# Altium schematic sheet 3.3v REG.SchDoc
size A; SheetNumber: 10; SheetTotal: 12
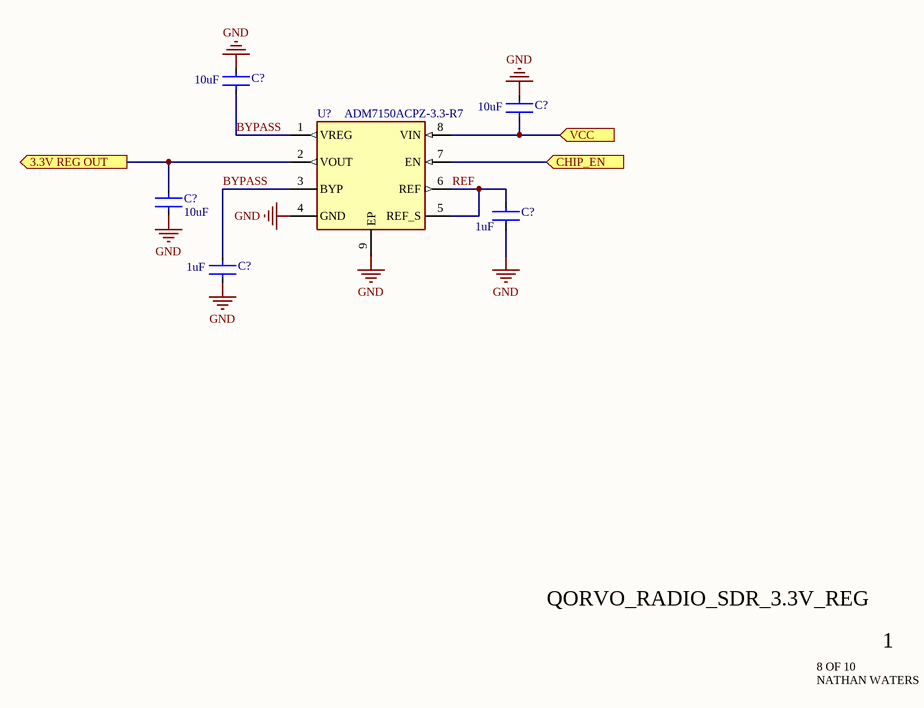
[diagram p0: 3.3v REG.SchDoc]

## Parts
(Parts that share a designator on the sheet are numbered #1, #2 ... from top to bottom, then left to right.)
C?#1  Capacitance: 10uF  [FP-GRM188-0_2-IPC_A]  (hidden comment: GRM188C81C106MA73D)
C?#2  Capacitance: 10uF  [FP-GRM188-0_2-IPC_A]  (hidden comment: GRM188C81C106MA73D)
C?#3  Capacitance: 10uF  [FP-GRM188-0_2-IPC_A]  (hidden comment: GRM188C81C106MA73D)
C?#4  CAPACITANCE: 1uF  [FP-GRM155-0_1-MFG]  (hidden comment: GRM155R61H105KE05D)
C?#5  CAPACITANCE: 1uF  [FP-GRM155-0_1-MFG]  (hidden comment: GRM155R61H105KE05D)
U?  ADM7150ACPZ-3.3-R7  [ADM7150ACPZ-3.3-R7]

## Ports
3.3V REG OUT (out, see LO[1A]), CHIP_EN (in, see HE Mixer[2C], LE Mixer[2C], LO[1B]), VCC (in, see HE LNA[3A], HE Mixer[3C], LE LNA[3A], LE Mixer[3C], LPF[1B], SWITCH[3B])

## Nets
GND: C?#1.2 C?#2.2 C?#3.2 C?#4.2 C?#5.2 U?.4(GND) U?.9(EP)
3.3V REG OUT: C?#3.1 U?.2(VOUT) ; port 3.3V REG OUT
BYPASS: C?#1.1 C?#5.1 U?.1(VREG) U?.3(BYP)
CHIP_EN: U?.7(EN) ; port CHIP_EN
REF: C?#4.1 U?.5(REF_S) U?.6(REF)
VCC: C?#2.1 U?.8(VIN) ; port VCC

## Notes on the sheet
- QORVO_RADIO_SDR_3.3V_REG
- 8 OF 10
- 1
- NATHAN WATERS

## Library data of the parts
C?#1-C?#3 = CMP-2006-02763-2: Chip Multilayer Ceramic Capacitors for General Purpose, 0603, 10uF, X6S, 22%, 20%, 16V; Height: 0.8mm; Package Quantity: 4000; Tolerance: 20%; Weight: 0.000222oz; Max Operating Temperature: 105°C; Thickness: 0.031inch; Termination: SMD/SMT; Case Code (Imperial): 0603; Width: 0.8mm; Min Operating Temperature: -55°C; Packaging: Tape and Reel; Length: 1.6mm; Depth: 0.8mm; Voltage Rating: 16V; Resistor Type: Ceramic; Voltage Rating (DC): 16V; Voltage: 16V; Mount: Surface Mount; Material: Ceramic; Case Code (Metric): 1608; Dielectric: X6S; Lead Free: Lead Free; REACH SVHC: No SVHC; Case/Package: 0603
C?#4 C?#5 = CMP-06035-026840-2: CERAMIC CAP, MLCC 1UF 50VDC X5R
U? = ADM7150ACPZ-3.3-R7: Volt Reg 3.3V; Manufacturer_Name: Analog Devices; Manufacturer_Part_Number: ADM7150ACPZ-3.3-R7; Datasheet Link: http://www.analog.com/media/en/technical-documentation/data-sheets/ADM7150.pdf